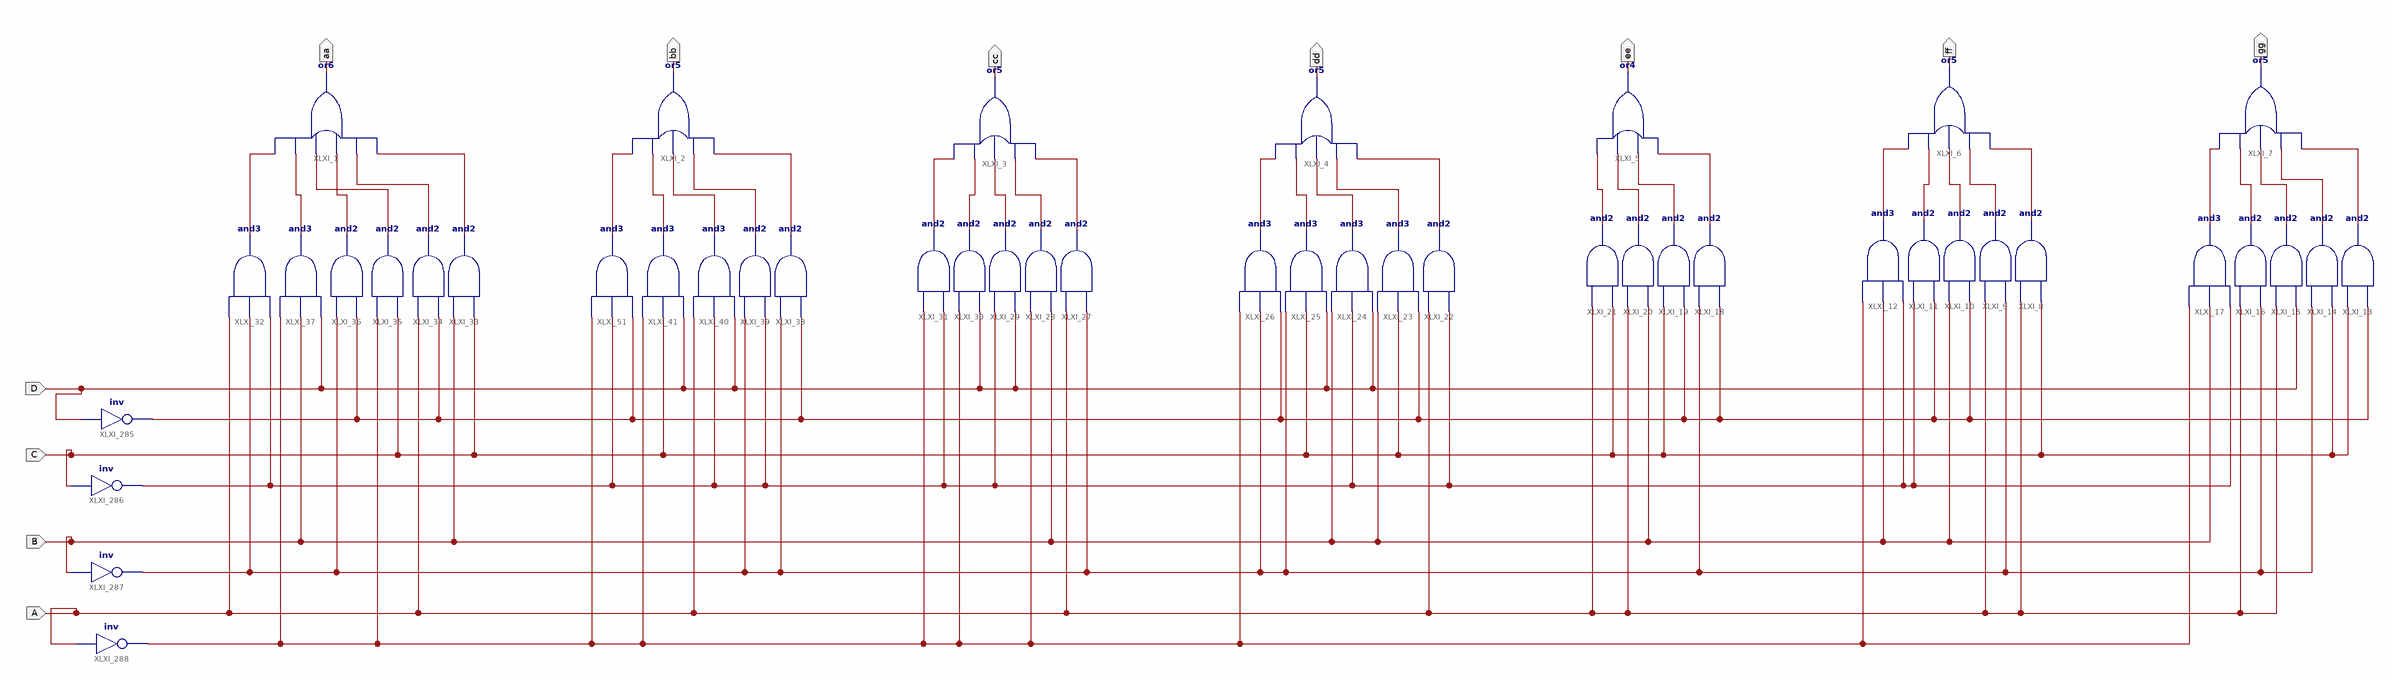
[diagram p0: schematic sheet 1]
// Xilinx ISE schematic sevennocomon.sch (spartan6) as structural Verilog: 46 symbols, 11 ports
module sevennocomon (
  input  D,
  input  C,
  input  B,
  input  A,
  output aa,
  output bb,
  output cc,
  output dd,
  output ee,
  output ff,
  output gg
);

  wire XLXN_2, XLXN_5, XLXN_8, XLXN_11, XLXN_12, XLXN_13, XLXN_14, XLXN_15, XLXN_16, XLXN_17, XLXN_18,
       XLXN_19, XLXN_20, XLXN_21, XLXN_22, XLXN_23, XLXN_24, XLXN_25, XLXN_26, XLXN_27, XLXN_28, XLXN_29,
       XLXN_30, XLXN_31, XLXN_32, XLXN_33, XLXN_34, XLXN_35, XLXN_36, XLXN_37, XLXN_38, XLXN_39, XLXN_40,
       XLXN_41, XLXN_45, XLXN_58, XLXN_87, XLXN_88, XLXN_89;

  or XLXI_1 (aa, XLXN_17, XLXN_16, XLXN_14, XLXN_15, XLXN_13, XLXN_12);
  or XLXI_2 (bb, XLXN_22, XLXN_21, XLXN_20, XLXN_19, XLXN_18);
  or XLXI_3 (cc, XLXN_27, XLXN_26, XLXN_25, XLXN_24, XLXN_23);
  or XLXI_4 (dd, XLXN_32, XLXN_31, XLXN_30, XLXN_29, XLXN_28);
  or XLXI_5 (ee, XLXN_36, XLXN_35, XLXN_34, XLXN_33);
  or XLXI_6 (ff, XLXN_41, XLXN_40, XLXN_39, XLXN_38, XLXN_37);
  or XLXI_7 (gg, XLXN_58, XLXN_45, XLXN_89, XLXN_88, XLXN_87);
  and XLXI_8 (XLXN_41, C, A);
  and XLXI_9 (XLXN_40, XLXN_11, A);
  and XLXI_10 (XLXN_39, XLXN_2, B);
  and XLXI_11 (XLXN_38, XLXN_2, XLXN_5);
  and XLXI_12 (XLXN_37, XLXN_5, B, XLXN_8);
  and XLXI_13 (XLXN_58, XLXN_2, C);
  and XLXI_14 (XLXN_45, C, XLXN_11);
  and XLXI_15 (XLXN_89, D, A);
  and XLXI_16 (XLXN_88, XLXN_11, A);
  and XLXI_17 (XLXN_87, XLXN_5, B, XLXN_8);
  and XLXI_18 (XLXN_36, XLXN_2, XLXN_11);
  and XLXI_19 (XLXN_35, XLXN_2, C);
  and XLXI_20 (XLXN_34, B, A);
  and XLXI_21 (XLXN_33, C, A);
  and XLXI_22 (XLXN_32, XLXN_5, A);
  and XLXI_23 (XLXN_31, XLXN_2, C, B);
  and XLXI_24 (XLXN_30, D, XLXN_5, B);
  and XLXI_25 (XLXN_29, D, C, XLXN_11);
  and XLXI_26 (XLXN_28, XLXN_2, XLXN_11, XLXN_8);
  and XLXI_27 (XLXN_27, XLXN_11, A);
  and XLXI_28 (XLXN_26, B, XLXN_8);
  and XLXI_29 (XLXN_25, D, XLXN_5);
  and XLXI_30 (XLXN_24, D, XLXN_8);
  and XLXI_31 (XLXN_23, XLXN_5, XLXN_8);
  and XLXI_32 (XLXN_12, XLXN_5, XLXN_11, A);
  and XLXI_33 (XLXN_17, C, B);
  and XLXI_34 (XLXN_16, XLXN_2, A);
  and XLXI_35 (XLXN_15, C, XLXN_8);
  and XLXI_36 (XLXN_14, XLXN_2, XLXN_11);
  and XLXI_37 (XLXN_13, D, B, XLXN_8);
  and XLXI_38 (XLXN_22, XLXN_2, XLXN_11);
  and XLXI_39 (XLXN_21, XLXN_5, XLXN_11);
  and XLXI_40 (XLXN_20, D, XLXN_5, A);
  and XLXI_41 (XLXN_19, D, C, XLXN_8);
  and XLXI_51 (XLXN_18, XLXN_2, XLXN_5, XLXN_8);
  not XLXI_285 (XLXN_2, D);
  not XLXI_286 (XLXN_5, C);
  not XLXI_287 (XLXN_11, B);
  not XLXI_288 (XLXN_8, A);
endmodule
